# Altium project Analog PCB.PrjPcb
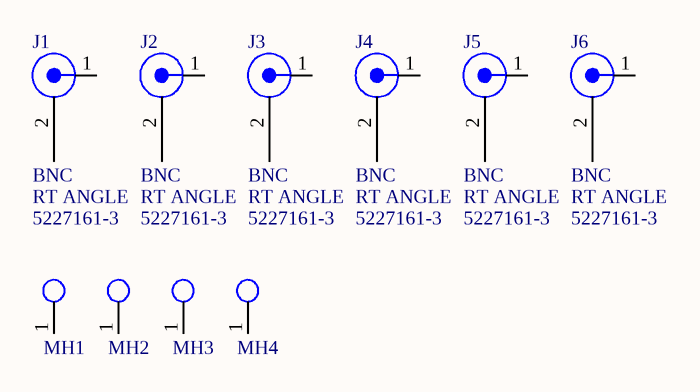
[diagram p0: Front End.SchDoc]
1 sheet, 10 parts. Net scope: global (net labels, ports and power ports of the same name join across sheets).
Board file: Analog PCB.PcbDoc

## Sheet Front End.SchDoc
size A; SheetNumber: 1; SheetTotal: 1

### Parts
J1  BNC  value RT ANGLE  Manf P/N: 5227161-3  [URF/BNC/R1.350/FIXED]
J2  BNC  value RT ANGLE  Manf P/N: 5227161-3  [URF/BNC/R1.350/FIXED]
J3  BNC  value RT ANGLE  Manf P/N: 5227161-3  [URF/BNC/R1.350/FIXED]
J4  BNC  value RT ANGLE  Manf P/N: 5227161-3  [URF/BNC/R1.350/FIXED]
J5  BNC  value RT ANGLE  Manf P/N: 5227161-3  [URF/BNC/R1.350/FIXED]
J6  BNC  value RT ANGLE  Manf P/N: 5227161-3  [URF/BNC/R1.350/FIXED]
MH1  HOLE_128  [HOLE_128]  (value not drawn)  (no BOM)
MH2  HOLE_128  [HOLE_128]  (value not drawn)  (no BOM)
MH3  HOLE_128  [HOLE_128]  (value not drawn)  (no BOM)
MH4  HOLE_128  [HOLE_128]  (value not drawn)  (no BOM)

### Nets

Not connected (* = marked no-connect by the designer): J1 1(CENTER) 2(SHIELD); J2 1(CENTER) 2(SHIELD); J3 1(CENTER) 2(SHIELD); J4 1(CENTER) 2(SHIELD); J5 1(CENTER) 2(SHIELD); J6 1(CENTER) 2(SHIELD); MH1 1; MH2 1; MH3 1; MH4 1

### Library data of the parts
J1-J6 = 1-00233: BNC, PCB Panel Mount, Right Angle, Isolated; Manf: TYCO; Cat1: Thru-hole; Cat2: Coax; Part Number: 1-00233; Type: Connector\Thru-hole\Coax\BNC; ComponentLink2URL: http://srsdata.corp.thinksrs.com:3838/ShinyParts/?Detail=100233; ComponentLink1URL: http://ventura.corp.thinksrs.com/datasheets/100233/datasheet.pdf; ComponentLink2Description: Info; ComponentLink1Description: datasheet; Cat3: BNC
MH1-MH4 = HOLE_128: 0.128 mounting hole, clearance for 4-40